# Altium schematic sheet 247-616_Pi-CAN.SchDoc: CAN Controller + Transceiver and Ctrl PWM
size Letter; ApprovedBy: APPROUVÉ PAR; Engineer: K.Cotton; Organization: Cegep Limoilou; Address1: 1300, 8e Avenue; Address2: Québec, QC; Address3: Canada; Address4: G1J 5L5; SheetNumber: 1; SheetTotal: 1
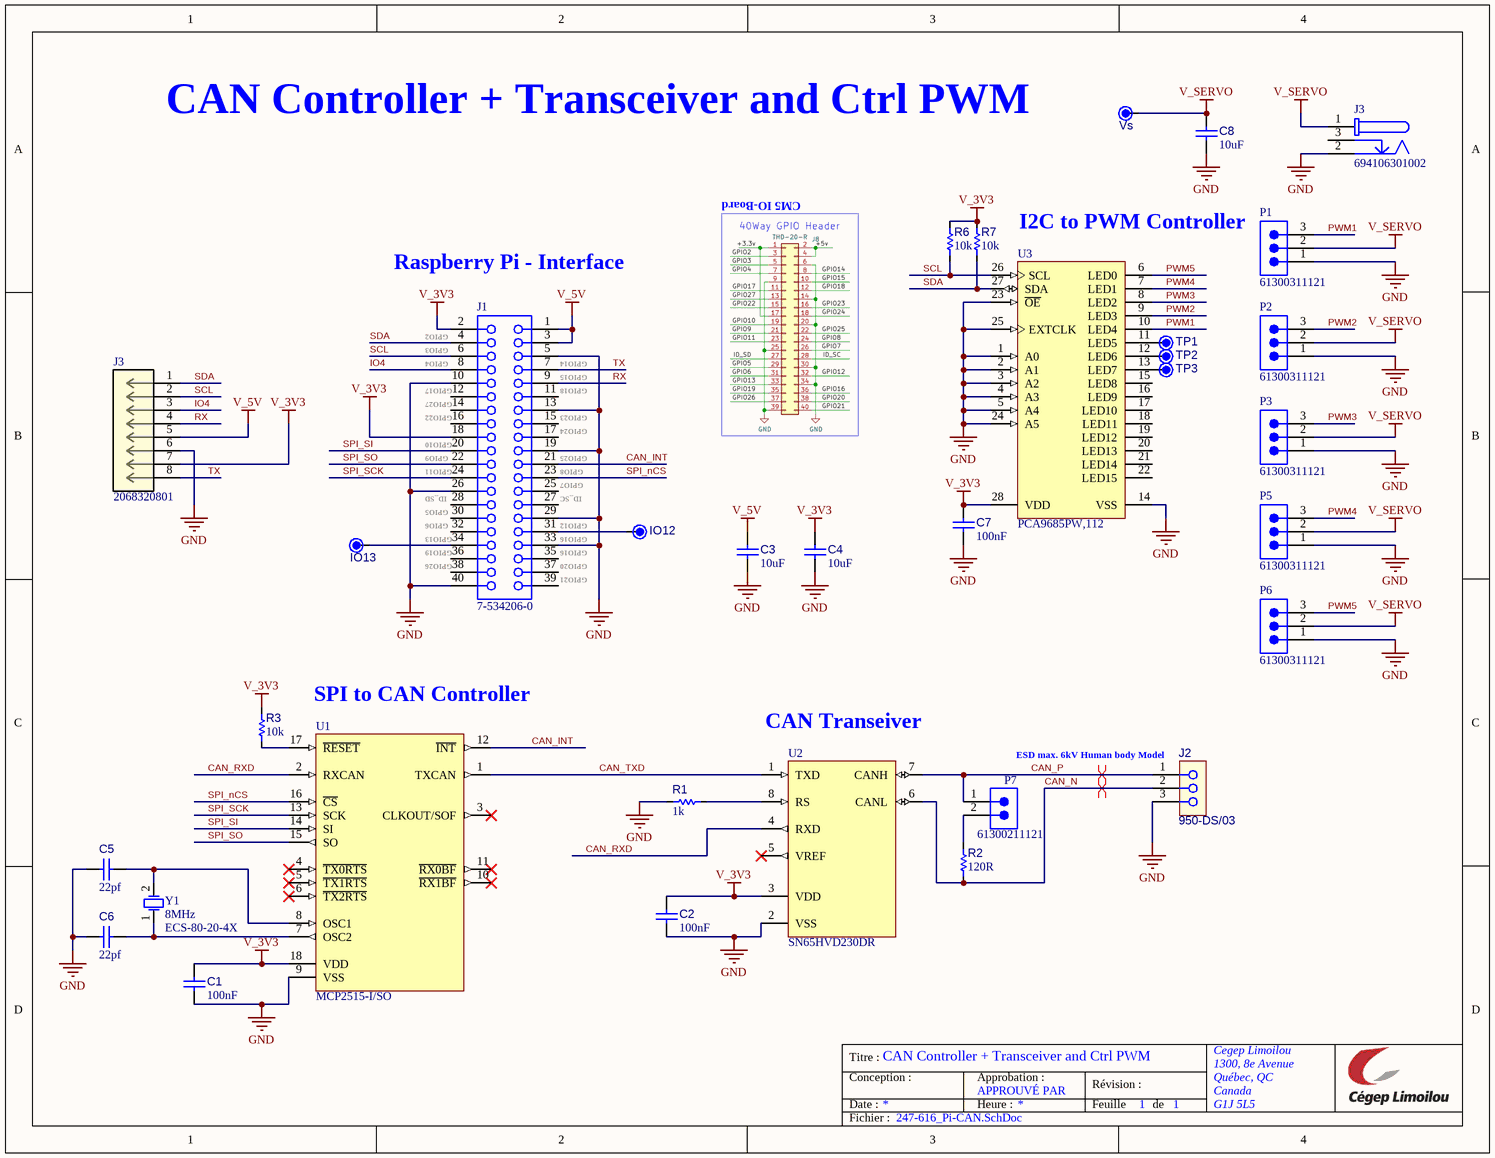
[diagram p0: 247-616_Pi-CAN.SchDoc]

## Parts
(Parts that share a designator on the sheet are numbered #1, #2 ... from top to bottom, then left to right.)
C1  value 100nF  [C_1608[0603]]  (hidden comment: Cap 100nF 0603)
C2  value 100nF  [C_1608[0603]]  (hidden comment: Cap 100nF 0603)
C3  value 10uF  [C_2012[0805]]  (hidden comment: Cap 10uF 0805)
C4  value 10uF  [C_2012[0805]]  (hidden comment: Cap 10uF 0805)
C5  value 22pf  [C0603]  (hidden comment: Cap 22pF 0603)
C6  value 22pf  [C0603]  (hidden comment: Cap 22pF 0603)
C7  value 100nF  [C_1608[0603]]  (hidden comment: Cap 100nF 0603)
C8  value 10uF  [C_2012[0805]]  (hidden comment: Cap 10uF 0805)
IO12  DNP  [TP_TH061]  (value not drawn)  (no BOM)
IO13  DNP  [TP_TH061]  (value not drawn)  (no BOM)
J1  7-534206-0  [CONN_HDR_FEM_2x20pos_100mil]
J2  950-DS/03  [J_TERM_BLOCK_3POS_TH_5mm_Model2]
J3#1  694106301002  [P_DC-JACK_RA]
J3#2  2068320801  [CONN_2068320000-SD_08_MOL]
P1  61300311121  [P_HDR_3POs_100MILS_TH]
P2  61300311121  [P_HDR_3POs_100MILS_TH]
P3  61300311121  [P_HDR_3POs_100MILS_TH]
P5  61300311121  [P_HDR_3POs_100MILS_TH]
P6  61300311121  [P_HDR_3POs_100MILS_TH]
P7  61300211121  [P_HDR_2POS_100MILS_TH]
R1  value 1k  [R_1608[0603]]  (hidden comment: Res 1k 1% 0603)
R2  value 120R  [R_3216[1206]]  (hidden comment: Res 120R 5% 1206)
R3  value 10k  [R_1608[0603]]  (hidden comment: Res 10k 1% 0603)
R6  value 10k  [R_1608[0603]]  (hidden comment: Res 10k 1% 0603)
R7  value 10k  [R_1608[0603]]  (hidden comment: Res 10k 1% 0603)
TP1  DNP  [TP_TH061]  (value not drawn)  (no BOM)
TP2  DNP  [TP_TH061]  (value not drawn)  (no BOM)
TP3  DNP  [TP_TH061]  (value not drawn)  (no BOM)
U1  MCP2515-I/SO  [SOIC18-1.27-11.5X7.5MM]
U2  SN65HVD230DR  [SOIC127P599X175-8N]
U3  PCA9685PW,112  [TSSOP28_SOT361-1_V]
Vs  DNP  [TP_TH061]  (value not drawn)  (no BOM)
Y1  ECS-80-20-4X  value 8MHz  [Y_HC-49-US]

## Nets
GND: C1.1 C2.1 C3.1 C4.1 C5.2 C6.2 C7.1 C8.1 J1.5 J1.10 J1.13 J1.19 J1.26 J1.29 J1.33 J1.40 J2.3 J3#1.2 J3#2.6 P1.1 P2.1 P3.1 P5.1 P6.1 R1.1 U1.9(VSS) U2.2(VSS) U3.1(A0) U3.2(A1) U3.3(A2) U3.4(A3) U3.5(A4) U3.14(VSS) U3.23(~{OE}) U3.24(A5) U3.25(EXTCLK)
V_3V3: C1.2 C2.2 C4.2 C7.2 J1.2 J1.18 J3#2.7 R3.2 R6.2 R7.2 U1.18(VDD) U2.3(VDD) U3.28(VDD)
V_5V: C3.2 J1.1 J1.3 J3#2.5
V_SERVO: C8.2 J3#1.1 P1.2 P2.2 P3.2 P5.2 P6.2 Vs.1
CAN_INT: J1.21 U1.12(~{INT})
CAN_N: J2.2 R2.1 U2.6(CANL)
CAN_P: J2.1 P7.1 U2.7(CANH)
CAN_RXD: U1.2(RXCAN) U2.4(RXD)
CAN_TXD: U1.1(TXCAN) U2.1(TXD)
IO4: J1.8 J3#2.3
PWM1: P1.3 U3.10(LED4)
PWM2: P2.3 U3.9(LED3)
PWM3: P3.3 U3.8(LED2)
PWM4: P5.3 U3.7(LED1)
PWM5: P6.3 U3.6(LED0)
RX: J1.9 J3#2.4
SCL: J1.6 J3#2.2 R6.1 U3.26(SCL)
SDA: J1.4 J3#2.1 R7.1 U3.27(SDA)
SPI_nCS: J1.23 U1.16(~{CS})
SPI_SCK: J1.24 U1.13(SCK)
SPI_SI: J1.20 U1.14(SI)
SPI_SO: J1.22 U1.15(SO)
TX: J1.7 J3#2.8
NetC5_1: C5.1 U1.8(OSC1) Y1.2
NetC6_1: C6.1 U1.7(OSC2) Y1.1
NetIO12_1: IO12.1 J1.31
NetIO13_1: IO13.1 J1.34
NetP7_2: P7.2 R2.2
NetR1_2: R1.2 U2.8(RS)
NetR3_1: R3.1 U1.17(~{RESET})
NetTP1_1: TP1.1 U3.11(LED5)
NetTP2_1: TP2.1 U3.12(LED6)
NetTP3_1: TP3.1 U3.13(LED7)

Not connected (* = marked no-connect by the designer): J1 11 12 14 15 16 17 25 27 28 30 32 35 36 37 38 39; J3#1 3; U1 3(CLKOUT/SOF)* 4(~{TX0RTS})* 5(~{TX1RTS})* 6(~{TX2RTS})* 10(~{RX1BF})* 11(~{RX0BF})*; U2 5(VREF)*; U3 15(LED8) 16(LED9) 17(LED10) 18(LED11) 19(LED12) 20(LED13) 21(LED14) 22(LED15)

## Layout directives
differential pair: CAN_N, CAN_P

## Notes on the sheet
- CM5 IO-Board
- I2C to PWM Controller
- Raspberry Pi - Interface
- (near J1) GPIO2
- (near J1) GPIO3
- (near J1) GPIO4
- (near J1) GPIO14
- (near J1) GPIO17
- (near J1) GPIO27
- (near J1) GPIO22
- (near J1) GPIO15
- (near J1) GPIO23
- (near J1) GPIO24
- (near J1) GPIO18
- (near J1) GPIO9
- (near J1) GPIO10
- (near J1) GPIO11
- (near J1) ID_SD
- (near J1) GPIO7
- (near J1) GPIO8
- (near J1) GPIO25
- (near J1) ID_SC
- (near J1) GPIO13
- (near J1) GPIO26
- (near J1) GPIO6
- (near J1) GPIO19
- (near J1) GPIO5
- (near J1) GPIO12
- (near J1) GPIO16
- (near J1) GPIO20
- (near J1) GPIO21
- SPI to CAN Controller
- (near U2) CAN Transeiver
- (near J2) ESD max. 6kV Human body Model
- Titre :
- Conception :
- Date :
- Approbation :
- Heure :
- Révision :
- Feuille
- de
- Fichier :

## Library data of the parts
C1 C2 C7 = CAP002: Capacitor type 1; Manufacturer 1: Yageo; Manufacturer Part Number 1: CC0603KRX7R9BB104; LibRef: CAP002; CEGEP: COND0143SM; Tolerance: 10%; Rated Voltage: 50V; Dielectric: X7R; Mount: SMT; Supplier 1: LCSC; Supplier Part Number 1: C14663
C3 C4 C8 = CAP004: Capacitor type 1; Manufacturer 1: Samsung; Manufacturer Part Number 1: CL21A106KAYNNNE; LibRef: CAP004; CEGEP: KCOND03SM; Tolerance: 10%; Rated Voltage: 25V; Dielectric: X5R; Mount: SMT; Supplier 1: LCSC; Supplier Part Number 1: C15850
C5 C6 = CAP012: Capacitor type 1; Manufacturer 1: AVX; Manufacturer Part Number 1: 12065A220KAT2A; LibRef: CAP012; CEGEP: COND0002SM; Tolerance: 10%; Rated Voltage: 50V; Dielectric: C0G; Mount: SMT
IO12 IO13 TP1-TP3 Vs = TP_TH0.61mm(AWG28): Pad TH 0.61mm diameter (AWG28); Value: DNP; Manufacturer Part Number 1: DNP; Supplier Part Number 1: N/A; Supplier 1: N/A
J1 = J_HDR_RECEPTACLE_2X20_TH_100mils: CONN RCPT 40POS 0.1; Manufacturer 1: TE Connectivity; Manufacturer2_PN: PPTC202LFBN-RC; CEGEP: CON040; Manufacturer Part Number 1: 7-534206-0; Mount: TH; Supplier 1: Digi-Key; Supplier Part Number 1: S6104-ND; Manufacturer2: Sullins; ID_CEP: *; Fitted: Fitted; Manufacturer: TE Connectivity; PN_Manuf: 7-534206-0
J2 = J_TERM_BLOCK_3POS_5mm_MODEL2: CONN TERM BLOCK 3POS 5mm pitch; Manufacturer 1: Phoenix Contact; Manufacturer Part Number 1: 1890976; CEGEP: CONWECO0002; Manufacturer2: Weco; Manufacturer2_PN: 950-DS/03; Supplier 1: Digi-Key; Supplier Part Number 1: 277-6163-ND; Mount: TH; ID_CEP: *; PN_Manuf: 950-DS/03; Fitted: Fitted; Manufacturer: Phoenix Contact
J3#1 = J_DC_JACK_2.5MM: DC Barrel Connector 2.5mm; Manufacturer 1: XKB Connection; Manufacturer Part Number 1: DC-005-5A-2.5; Manufacturer: Würth Elektronik; Mount: TH; Supplier 1: LCSC; Supplier Part Number 1: C381115; Fitted: Fitted; ID_CEP: *; PN_Manuf: 694106301002
J3#2 = J_CONN_MICROFIT_8POS: Micro-Fit+ Vertical Header, Through Hole, 3.00mm Pitch, Dual Row, 8 Circuits, Tin (Sn) Plating, Glow-Wire Capable, Black, Tray; Manufacturer_Name: Molex Connector Corporation; Parameter 6: ID_CEP; Copyright: Copyright (C) 2025 Ultra Librarian. All rights reserved.; Manufacturer_Part_Number: 2068320801; RefDes: RefDes; Type: Type; Verif_1: *; Verif_2: *; PN_Manuf: 2068320801; Fitted: Fitted; Manufacturer: Molex Connector Corporation
P1-P3 P5 P6 = P_HEADER_3POS: Header 3pins single row, TH; Manufacturer 1: Würth Elektronik; Manufacturer Part Number 1: 61300311121; Mount: TH; Supplier 1: Digi-Key; Supplier Part Number 1: 732-5316-ND; Fitted: Fitted; PN_Manuf: 61300311121; ID_CEP: *; Manufacturer: Würth Elektronik
P7 = P_HEADER_2POS: Header 2pins single row , 100mils TH; Manufacturer 1: Würth Elektronik; Manufacturer Part Number 1: 61300211121; Mount: TH; Supplier 1: Digi-Key; Supplier Part Number 1: 732-5315-ND; ID_CEP: *; Fitted: Fitted; PN_Manuf: 61300211121; Manufacturer: Würth Elektronik
R1 = RES015: Resistor type 1; Manufacturer 1: Yageo; Manufacturer Part Number 1: RC0603FR-071KL; LibRef: RES015; Puissance: 1/10W; Max Working Voltage: 75V; Tolerance: 1%; Mount: SMT; Supplier 1: LCSC; Supplier Part Number 1: C22548
R2 = RES014: Resistor type 1; Manufacturer 1: Panasonic; Manufacturer Part Number 1: ERJ-8GEYJ121V; LibRef: RES014; Puissance: 1/4W; Max Working Voltage: 50V; Tolerance: 5%; Mount: SMT; Supplier 1: Digikey; Supplier Part Number 1: P120ECT-ND
R3 R6 R7 = RES001: Resistor type 1; Manufacturer 1: Yageo; Manufacturer Part Number 1: RC0603FR-0710KL; LibRef: RES001; CEGEP: RESI0238-0603; Puissance: 1/10W; Max Working Voltage: 75V; Tolerance: 1%; Mount: SMT; Supplier 1: LCSC; Supplier Part Number 1: C98220
U1 = U_MCP2515-SOIC: CANbus Controller CAN 2.0 SPI Interface 18-SOIC; Manufacturer 1: Microchip; Manufacturer Part Number 1: MCP2515T-I/SO; Supplier 1: Digi-Key; Supplier Part Number 1: MCP2515T-I/SO; Mount: SMT; ID_CEP: *; Fitted: Fitted; Manufacturer: Microchip; PN_Manuf: MCP2515-I/SO
U2 = U_SN65HVD230DR_SOIC: IC TRANSCEIVER HALF 1/1 8SOIC; Manufacturer 1: Texas Instruments; Manufacturer Part Number 1: SN65HVD230DR; Mount: SMT; ID_CEP: *; Fitted: Fitted; PN_Manuf: SN65HVD230DR; Manufacturer: Texas Instruments
U3 = U_PCA9685PW: 16-Channel, 12-Bit PWM I2C-Bus LED Controller, 28-Pin TSSOP (SOT361-1); Manufacturer 1: NXP; Manufacturer: NXP USA Inc.; Manufacturer Part Number 1: PCA9685PW,112; Mount: SMT; Supplier 1: Digi-Key; Supplier Part Number 1: 568-8366-5-ND; ID_CEP: *; Fitted: Fitted; PN_Manuf: PCA9685PW,112
Y1 = Y_XTAL_8MHz_HC49US: Crystal 8MHz TH; Manufacturer 1: ECS; Manufacturer: ECS Inc.; Tolerance: 50ppm; CEGEP: CRISTAL0041; Mount: TH; Manufacturer Part Number 1: ECS-80-20-4X; Supplier 1: Digi-Key; Supplier Part Number 1: XC1922-ND; PN_Manuf: ECS-80-20-4X; Fitted: Fitted; ID_CEP: *